# EAGLE design Bertha_v4_2 (EAGLE 7.5.0)
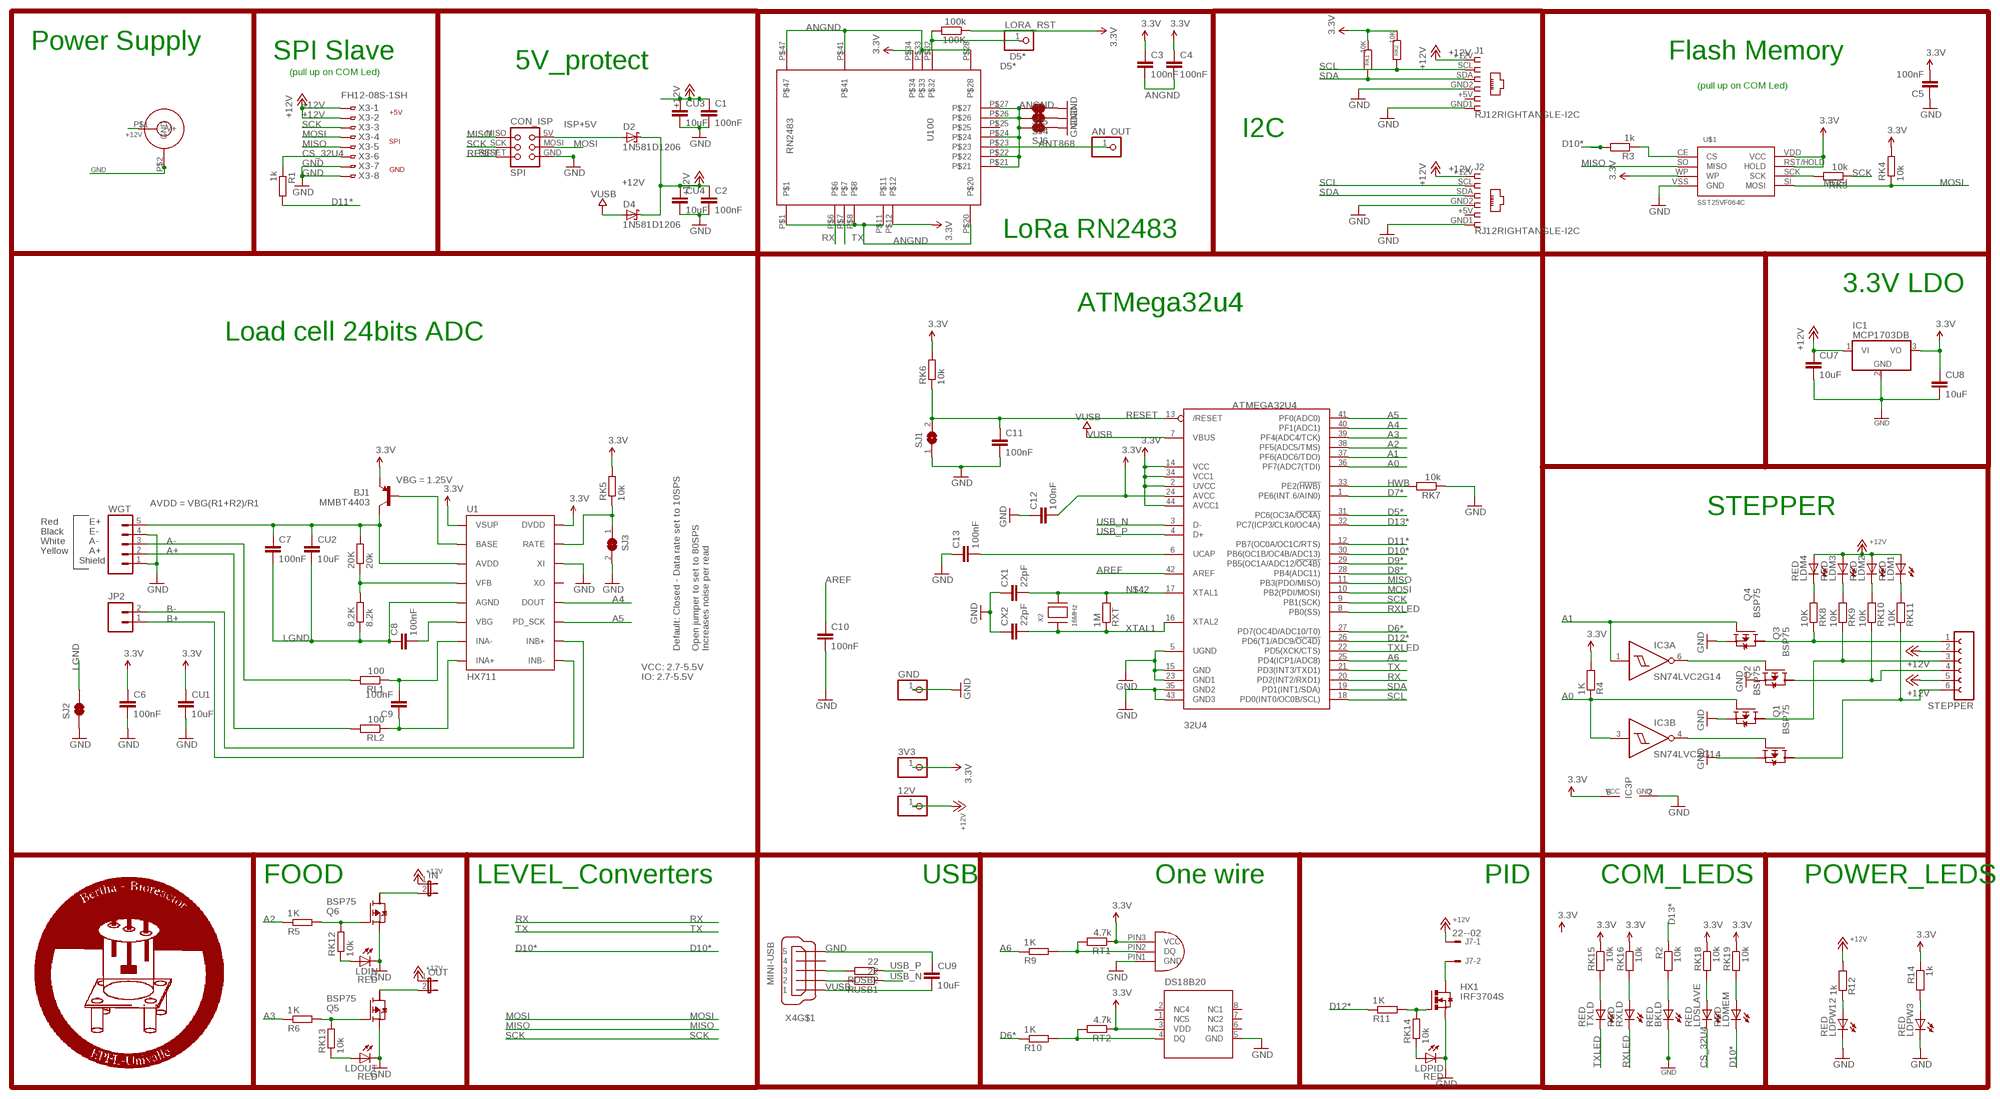
[diagram p0: schematic, sheet 1]

## Parts
3V3  PINHD-1X1  [1X01]
8.2K  8.2k  R-EU_M0805  [M0805]
12V  PINHD-1X1  [1X01]
20K  20k  R-EU_M0805  [M0805]
32U4  ATMEGA32U4  ATMEGA32U4-AU  [TQFP44]
100K  100k  R-EU_R0805  [R0805]
AN_OUT  PINHD-1X1  [1X01]
BJ1  MMBT4403  TRANSISTOR_PNPMMBT4403  [SOT23-3]
BKLD  RED  LEDCHIP-LED0805  [CHIP-LED0805]
C1  100nF  C-EUC1206  [C1206]
C2  100nF  C-EUC1206  [C1206]
C3  100nF  C-EUC1206  [C1206]
C4  100nF  C-EUC1206  [C1206]
C5  100nF  C-EUC1206  [C1206]
C6  100nF  C-EUC1206  [C1206]
C7  100nF  C-EUC1206  [C1206]
C8  100nF  C-EUC1206  [C1206]
C9  100nF  C-EUC1206  [C1206]
C10  100nF  C-EUC1206  [C1206]
C11  100nF  C-EUC1206  [C1206]
C12  100nF  C-EUC1206  [C1206]
C13  100nF  C-EUC1206  [C1206]
CON1  JACK_DC_BARREL  [DC_BARREL]
CON_ISP  SPI  TINYISPT  [TC2030-MCP-NL]
CU1  10uF  C-EUC1206  [C1206]
CU2  10uF  C-EUC1206  [C1206]
CU3  10uF  C-EUC1206  [C1206]
CU4  10uF  C-EUC1206  [C1206]
CU7  10uF  C-EUC1206  [C1206]
CU8  10uF  C-EUC1206  [C1206]
CU9  10uF  C-EUC1206  [C1206]
CX1  22pF  C-EUC1206  [C1206]
CX2  22pF  C-EUC1206  [C1206]
D2  1N581D1206  [LED-1206]
D4  1N581D1206  [LED-1206]
GND  PINHD-1X1  [1X01]
HX1  IRF3704S  [D2PACK]
IC1  MCP1703DB  [SOT223]
IC3  SN74LVC2G14  [SOT23-6]
IN  JP1E  [JP1]
J1  RJ12RIGHTANGLE-I2C  [RJ12-RIGHTANGLE-I2C]
J2  RJ12RIGHTANGLE-I2C  [RJ12-RIGHTANGLE-I2C]
J7  22--02  [2-PIN-5.08S]
JP2  M02PTH  [1X02]
LDIN  RED  LEDCHIP-LED0805  [CHIP-LED0805]
LDM1  RED  LEDCHIP-LED0805  [CHIP-LED0805]
LDM2  RED  LEDCHIP-LED0805  [CHIP-LED0805]
LDM3  RED  LEDCHIP-LED0805  [CHIP-LED0805]
LDM4  RED  LEDCHIP-LED0805  [CHIP-LED0805]
LDMEM  RED  LEDCHIP-LED0805  [CHIP-LED0805]
LDOUT  RED  LEDCHIP-LED0805  [CHIP-LED0805]
LDPID  RED  LEDCHIP-LED0805  [CHIP-LED0805]
LDPW3  RED  LEDCHIP-LED0805  [CHIP-LED0805]
LDPW12  RED  LEDCHIP-LED0805  [CHIP-LED0805]
LDSLAVE  RED  LEDCHIP-LED0805  [CHIP-LED0805]
LORA_RST  PINHD-1X1  [1X01]
OUT  JP1E  [JP1]
Q1  BSP75  BSP613P  [PG-SOT-223]
Q2  BSP75  BSP613P  [PG-SOT-223]
Q3  BSP75  BSP613P  [PG-SOT-223]
Q4  BSP75  BSP613P  [PG-SOT-223]
Q5  BSP75  BSP613P  [PG-SOT-223]
Q6  BSP75  BSP613P  [PG-SOT-223]
R1  1k  R-EU_R0805  [R0805]
R2  10k  R-EU_R0805  [R0805]
R3  1k  R-EU_R0805  [R0805]
R4  1K  R-EU_R0805  [R0805]
R5  1K  R-EU_R0805  [R0805]
R6  1K  R-EU_R0805  [R0805]
R9  1K  R-EU_R0805  [R0805]
R10  1K  R-EU_R0805  [R0805]
R11  1K  R-EU_R0805  [R0805]
R12  1k  R-EU_R0805  [R0805]
R14  1k  R-EU_R0805  [R0805]
RK1  10K  R-EU_M0805  [M0805]
RK2  10K  R-EU_M0805  [M0805]
RK3  10k  R-EU_R0805  [R0805]
RK4  10k  R-EU_R0805  [R0805]
RK5  10k  R-EU_M0805  [M0805]
RK6  10k  R-EU_M0805  [M0805]
RK7  10k  R-EU_M0805  [M0805]
RK8  10K  R-EU_R0805  [R0805]
RK9  10K  R-EU_R0805  [R0805]
RK10  10K  R-EU_R0805  [R0805]
RK11  10K  R-EU_R0805  [R0805]
RK12  10k  R-EU_R0805  [R0805]
RK13  10k  R-EU_R0805  [R0805]
RK14  10k  R-EU_R0805  [R0805]
RK15  10k  R-EU_R0805  [R0805]
RK16  10k  R-EU_R0805  [R0805]
RK18  10k  R-EU_R0805  [R0805]
RK19  10k  R-EU_R0805  [R0805]
RL1  100  R-EU_M0805  [M0805]
RL2  100  R-EU_M0805  [M0805]
RT1  4.7k  R-EU_R1206  [R1206]
RT2  4.7k  R-EU_R1206  [R1206]
RUSB1  22  R-EU_M1206  [M1206]
RUSB2  22  R-EU_M1206  [M1206]
RXLD  RED  LEDCHIP-LED0805  [CHIP-LED0805]
RXT  1M  R-EU_R0805  [R0805]
SJ1  SJ  [SJ]
SJ2  JUMPER-PAD-2-NC_BY_TRACE  [PAD-JUMPER-2-NC_BY_TRACE_YES_SILK]
SJ3  SJ  [SJ]
SJ4  JUMPER-PAD-2-NC_BY_TRACE  [PAD-JUMPER-2-NC_BY_TRACE_YES_SILK]
SJ5  JUMPER-PAD-2-NC_BY_TRACE  [PAD-JUMPER-2-NC_BY_TRACE_YES_SILK]
SJ6  JUMPER-PAD-2-NC_BY_TRACE  [PAD-JUMPER-2-NC_BY_TRACE_YES_SILK]
STEPPER  FE06-1  [FE06]
TXLD  RED  LEDCHIP-LED0805  [CHIP-LED0805]
U1  HX711  HX711HX711  [SO16]
U100  RN2483  [RN2483]
U$1  SST25VF064C  [SOIC_8-LEAD]
U$4  DS18B20  [SO8]
U$8  DS18B20_SMALLPADS  [SMALLPADS_X3]
WGT  M05PTH  [1X05]
X2  16MHz  XTALNX6035  [NX6035]
X3  FH12-08S-1SH  [FH12-08S-1SH]
X4  MINI-USB  MINI-USB-SCHIELD-32005-201  [32005-201]

## Nets
3.3V [power]: 3V3.1 32U4.2(UVCC) 32U4.14(VCC) 32U4.24(AVCC) 32U4.34(VCC1) 32U4.44(AVCC1) 100K.1 BJ1.2(E) C3.1 C4.1 C5.2 C6.1 C12.2 CU1.1 CU8.1 IC1.3(VO) IC3.5(P:VCC) R4.2 R14.1 RK1.1 RK2.1 RK4.2 RK5.2 RK6.2 RK15.1 RK16.1 RK18.1 RK19.1 RT1.1 RT2.1 U1.1(VSUP) U1.16(DVDD) U100.P$12 U100.P$34 U$1.RST/HOLD(HOLD) U$1.VDD(VCC) U$1.WP U$4.3(VDD) U$8.PIN3(VCC)
+12V [power]: 12V.1 C1.1 C2.1 CON1.P$1(V+) CU3.1 CU4.1 CU7.1 D2.C D4.C IC1.1(VI) IN.1 J1.+12V J2.+12V J7.1 LDM1.A LDM2.A LDM3.A LDM4.A OUT.1 R12.2 STEPPER.2 STEPPER.5 X3.1 X3.2
A0: 32U4.36(PF7(ADC7(TDI)) IC3.3(B:I) Q2.1(G) R4.1
A1: 32U4.37(PF6(ADC6/TDO)) IC3.1(A:I) Q4.1(G)
A2: 32U4.38(PF5(ADC5/TMS)) R5.1
A3: 32U4.39(PF4(ADC4/TCK)) R6.1
A4: 32U4.40(PF1(ADC1)) U1.12(DOUT)
A5: 32U4.41(PF0(ADC0)) U1.11(PD_SCK)
A6: 32U4.25(PD4(ICP1/ADC8)) R9.1
A+: RL2.2 WGT.2
A-: RL1.2 WGT.3
ANGND: C3.2 C4.2 SJ4.2 SJ5.2 SJ6.2 U100.P$1 U100.P$8 U100.P$11 U100.P$20 U100.P$21 U100.P$22 U100.P$24 U100.P$26 U100.P$27 U100.P$28 U100.P$33 U100.P$41 U100.P$47
ANT868: AN_OUT.1 U100.P$23
AREF: 32U4.42(AREF) C10.1
B+: JP2.1 U1.10(INB+)
B-: JP2.2 U1.9(INB-)
CN3: C8.2 U1.6(VBG)
CS_32U4: LDSLAVE.C R1.1 X3.6
D5*: 32U4.31(PC6(OC3A/!OC4A)) 100K.2 LORA_RST.1 U100.P$32
D6*: 32U4.27(PD7(OC4D/ADC10/T0)) R10.1
D7*: 32U4.1(PE6(INT.6/AIN0))
D8*: 32U4.28(PB4(ADC11))
D9*: 32U4.29(PB5(OC1A/ADC12/!OC4B))
D10*: 32U4.30(PB6(OC1B/OC4B/ADC13)) LDMEM.C R3.2
D11*: 32U4.12(PB7(OC0A/OC1C/RTS)) R1.2
D12*: 32U4.26(PD6(T1/ADC9/!OC4D)) R11.1
D13*: 32U4.32(PC7(ICP3/CLK0/OC4A)) R2.1
GND [power]: 32U4.5(UGND) 32U4.15(GND) 32U4.23(GND1) 32U4.35(GND2) 32U4.43(GND3) BKLD.C C1.2 C2.2 C5.1 C6.2 C10.2 C11.2 C12.1 C13.1 CON1.P$2(GND) CON_ISP.GND CU1.2 CU3.2 CU4.2 CU7.2 CU8.2 CU9.1 CX1.1 CX2.1 GND.1 HX1.3(S) IC1.2(GND) IC3.2(P:GND) J1.GND1 J1.GND2 J2.GND1 J2.GND2 LDIN.C LDOUT.C LDPID.C LDPW3.C LDPW12.C Q1.3(S) Q2.3(S) Q3.3(S) Q4.3(S) Q5.3(S) Q6.3(S) RK7.1 SJ1.1 SJ2.1 SJ3.2 SJ4.1 SJ5.1 SJ6.1 U1.14(XI) U$1.VSS(GND) U$4.5(GND) U$8.PIN1(GND) WGT.1 WGT.4 X3.7 X3.8 X4.5
HWB: 32U4.33(PE2(!HWB)) RK7.2
ISP+5V: CON_ISP.5V(VCC) D2.A
LGND: 8.2K.1 C7.2 C8.1 CU2.2 SJ2.2 U1.5(AGND)
MISO: 32U4.11(PB3(PDO/MISO)) CON_ISP.MISO U$1.SO(MISO) X3.5
MOSI: 32U4.10(PB2(PDI/MOSI)) CON_ISP.MOSI RK4.1 U$1.SI(MOSI) X3.4
N$1: 32U4.6(UCAP) C13.2
N$3: BKLD.A R2.2
N$5: 20K.2 BJ1.3(C) C7.1 CU2.1 U1.3(AVDD) WGT.5
N$6: HX1.1(G) R11.2 RK14.2
N$7: LDPW12.A R12.1
N$8: Q6.1(G) R5.2 RK12.2
N$9 [power]: R10.2 RT2.2 U$4.4(DQ)
N$10: R3.1 U$1.CE(CS)
N$11: Q5.1(G) R6.2 RK13.2
N$13: OUT.2 Q5.2(D)
N$14 [power]: Q4.2(D) RK8.1 STEPPER.1
N$15 [power]: Q2.2(D) RK9.1 STEPPER.3
N$16 [power]: Q3.2(D) RK10.1 STEPPER.4
N$17: IN.2 Q6.2(D)
N$18: RK15.2 TXLD.A
N$19 [power]: Q1.2(D) RK11.1 STEPPER.6
N$20: C9.2 RL1.1 U1.7(INA-)
N$21 [power]: R9.2 RT1.2 U$8.PIN2(DQ)
N$22: LDSLAVE.A RK18.2
N$23: RK3.2 U$1.SCK
N$24: RK16.2 RXLD.A
N$25: LDMEM.A RK19.2
N$26 [power]: LDPID.A RK14.1
N$27: LDIN.A RK12.1
N$28: LDOUT.A RK13.1
N$29: IC3.6(A:O) Q3.1(G)
N$30: IC3.4(B:O) Q1.1(G)
N$31: LDM4.C RK8.2
N$32: LDM3.C RK9.2
N$33: LDM2.C RK10.2
N$34: LDPW3.A R14.2
N$36: HX1.2(D) J7.2
N$37: LDM1.C RK11.2
N$38: BJ1.1(B) U1.2(BASE)
N$39: 8.2K.2 20K.1 U1.4(VFB)
N$41: RK5.1 SJ3.1 U1.15(RATE)
N$42: 32U4.17(XTAL1) CX1.2 RXT.2 X2.P$2
N$43: C9.1 RL2.1 U1.8(INA+)
RESET: 32U4.13(/RESET) C11.1 CON_ISP.RESET RK6.1 SJ1.2
RX: 32U4.20(PD2(INT2/RXD1)) U100.P$6
RXLED: 32U4.8(PB0(SS)) RXLD.C
SCK: 32U4.9(PB1(SCK)) CON_ISP.SCK RK3.1 X3.3
SCL: 32U4.18(PD0(INT0/OC0B/SCL)) J1.SCL J2.SCL RK2.2
SDA: 32U4.19(PD1(INT1/SDA)) J1.SDA J2.SDA RK1.2
TX: 32U4.21(PD3(INT3/TXD1)) U100.P$7
TXLED: 32U4.22(PD5(XCK/CTS)) TXLD.C
USB_N: 32U4.3(D-) RUSB1.1
USB_P: 32U4.4(D+) RUSB2.1
USBC_N: RUSB1.2 X4.2
USBC_P: RUSB2.2 X4.3
VUSB: 32U4.7(VBUS) CU9.2 D4.A X4.1
XTAL1: 32U4.16(XTAL2) CX2.2 RXT.1 X2.P$1
Unconnected: Q1.4(D) Q2.4(D) Q3.4(D) Q4.4(D) Q5.4(D) Q6.4(D) U1.13(XO) U100.P$25 U$4.1(NC5) U$4.2(NC4) U$4.6(NC3) U$4.7(NC2) U$4.8(NC1) X4.4 X4.M1(S:S1) X4.M2(S:S2) X4.M3(S:S3) X4.M4(S:S4)

## Notes on the sheet
- Power Supply
- SPI Slave | Flash Memory
- 5V_protect
- (pull up on COM Led)
- (pull up on COM Led)
- +5V
- I2C
- SPI
- GND
- LoRa RN2483
- 3.3V LDO
- ATMega32u4
- Load cell 24bits ADC
- VBG = 1.25V
- AVDD = VBG(R1+R2)/R1
- STEPPER
- Red | E+
- Black | E-
- White | A-
- Yellow | A+
- Shield
- Default: Closed - Data rate set to 10SPS
- Open jumper to set to 80SPS
  Increases noise per read
- VCC: 2.7-5.5V
- IO: 2.7-5.5V
- FOOD | LEVEL_Converters | USB | One wire | PID | COM_LEDS | POWER_LEDS

## Power pins joined to a net without a drawn wire
5: J1.+5V J2.+5V

## Library data of the parts
3V3 12V AN_OUT GND LORA_RST = Headerlibrary:PINHD-1X1: PIN HEADER
8.2K 20K R14 RK1 RK2 RK5-RK7 RL1 RL2 RT1 RT2 RUSB1 RUSB2 = resistor:R-EU_: RESISTOR, European symbol
32U4 = adafruit:ATMEGA32U4: http://www.ladyada.net/library/eagle
100K R1-R6 R9-R12 RK3 RK4 RK8-RK16 RK18 RK19 RXT = rcl:R-EU_: RESISTOR, European symbol
BJ1 = SparkFun-DiscreteSemi:TRANSISTOR_PNP: Generic PNP BJT Double check pinouts against datasheets- not all devices are the same! MMBT3906 - 40V 200mA SOT-23 (TRANS-08052) MMBT4403 - 40V 600mA SOT-23 (TRANS-09245); PROD_ID: TRANS-09245
BKLD LDIN LDM1-LDM4 LDMEM LDOUT LDPID LDPW3 LDPW12 LDSLAVE RXLD TXLD = adafruit:LED: LED OSRAM: - CHIPLED LG R971, LG N971, LY N971, LG Q971, LY Q971, LO R971, LY R971 LH N974, LH R974 LS Q976, LO Q976, LY Q976 LO Q996 - Hyper CHIPLED LW Q18S LB Q993, LB Q99A, LB R99A - SideLED LS A670, LO A670, LY A670, LG A670, LP A670 LB A673, LV A673, LT A673, LW A673 LH A674 LY A675 LS A676, LA A676, LO A676, LY A676, LW A676 LS A679, LY A679, LG A679 - Hyper Micro SIDELED® LS Y876, LA Y876, LO Y876, LY Y876 LT Y87S - SmartLED LW L88C, LW L88S LB L89C, LB L89S, LG L890 LS L89K, LO L89K, LY L89K LS L896, LA L896, LO L896, LY L896 - TOPLED LS T670, LO T670, LY T670, LG T670, LP T670 LSG T670, LSP T670, LSY T670, LOP T670, LYG T670 LG T671, LOG T671, LSG T671 LB T673, LV T673, LT T673, LW T673 LH T674 LS T676, LA T676, LO T676, LY T676, LB T676, LH T676, LSB T676, LW T676 LB T67C, LV T67C, LT T67C, LS T67K, LO T67K, LY T67K, LW E67C LS E67B, LA E67B, LO E67B, LY E67B, LB E67C, LV E67C, LT E67C LW T67C LS T679, LY T679, LG T679 LS T770, LO T770, LY T770, LG T770, LP T770 LB T773, LV T773, LT T773, LW T773 LH T774 LS E675, LA E675, LY E675, LS T675 LS T776, LA T776, LO T776, LY T776, LB T776 LHGB T686 LT T68C, LB T68C - Hyper Mini TOPLED® LB M676 - Mini TOPLED Santana® LG M470 LS M47K, LO M47K, LY M47K Source: http://www.osram.convergy.de/
C1-C13 CU1-CU4 CU7-CU9 CX1 CX2 = rcl:C-EU: CAPACITOR, European symbol
CON1 = lpatiny:JACK_DC_BARREL
CON_ISP = lpatiny:TINYISP: CONNECTOR
D2 D4 = lpatiny:1N581*: 1.0A SCHOTTKY BARRIER RECTIFIER Source: http://www.diodes.com/datasheets/ds23001.pdf
HX1 = transistor-power:IRF3704: SMPS MOSFET HEXFET® Power MOSFET Source: http://www.irf.com/product-info/datasheets/data/irf3704.pdf
IC1 = linear:MCP1703: 250 mA, 16V, Low Quiescent Current LDO Regulator Source: http://ww1.microchip.com/downloads/en/DeviceDoc/22049b.pdf
IC3 = lpatiny:SN74LVC2G14: Dual schmitt trigger INVERTER
IN OUT = jumper:JP1E: JUMPER
J1 J2 = lpatiny:RJ12: CORCOM Modular RJ Jacks No Shield Source: www.tycoelectronics.com .. ENG_DS_1654001_1099_RJ_L_0507.pdf
J7 = lpatiny:22-?-02: CONNECTOR wire to board 2.54 mm (.1 inch) pitch header
JP2 = SparkFun-Connectors:M02: Standard 2-pin 0.1" header. Use with - straight break away headers ( PRT-00116) - right angle break away headers (PRT-00553) - swiss pins (PRT-00743) - machine pins (PRT-00117) - female headers (PRT-00115) Molex polarized connector foot print use with: PRT-08233 with associated crimp pins and housings. 2.54_SCREWTERM for use with PRT-10571. 3.5mm Screw Terminal footprints for PRT-08084 5mm Screw Terminal footprints for use with PRT-08432
Q1-Q6 = infineon:BSP613P: SIPMOS (R) Small-Signal-Transistor P-Channel (2 Drain) Source: http://www.infineon.com/dgdl/BSP613P_Rev2.4.pdf; OC_FARNELL: unknown; OC_NEWARK: unknown
SJ1 SJ3 = jumper:SJ: SMD solder JUMPER
SJ2 SJ4-SJ6 = SparkFun-Passives:JUMPER-PAD-2-NC_BY_TRACE
STEPPER = con-lsta:FE06-1: FEMALE HEADER; OC_FARNELL: unknown; OC_NEWARK: unknown
U1 = Testing:HX711; PROD_ID: IC-12445
U100 = Octanis1:RN2483: Microchip Low-Power Long Range LoRaTM Technology Transceiver Module
U$1 = BertaLib:SST25VF064C
U$4 = lpatiny:DS18B20
U$8 = lpatiny:DS18B20_SMALLPADS
WGT = SparkFun-Connectors:M05: Header 5 Standard 5-pin 0.1" header. Use with straight break away headers (SKU : PRT-00116), right angle break away headers (PRT-00553), swiss pins (PRT-00743), machine pins (PRT-00117), and female headers (PRT-00115). Molex polarized connector foot print use with SKU : PRT-08230 with associated crimp pins and housings.
X2 = lpatiny:XTAL: Low cost SMT crystals, no capacitors included http://www.ladyada.net/library/eagle
X3 = con-hirose:FH12-08S-1S: 1mm Pitch Connectors For FPC/FFC Source: Data sheet <http://www.hirose.co.jp/cataloge_hp/e58605370.pdf>; OC_FARNELL: unknown; OC_NEWARK: unknown
X4 = con-cypressindustries:MINI-USB-SCHIELD-: MINI USB-B Conector Source: www.cypressindustries.com; OC_FARNELL: unknown; OC_NEWARK: unknown

## Net classes
0 default: width 0.203 mm
1 power: width 0.203 mm, drill 0.305 mm, clearance 0.152 mm
2 VIN: width 0.457 mm
3 fine: width 0.254 mm
4 aref: width 0.356 mm

## Board
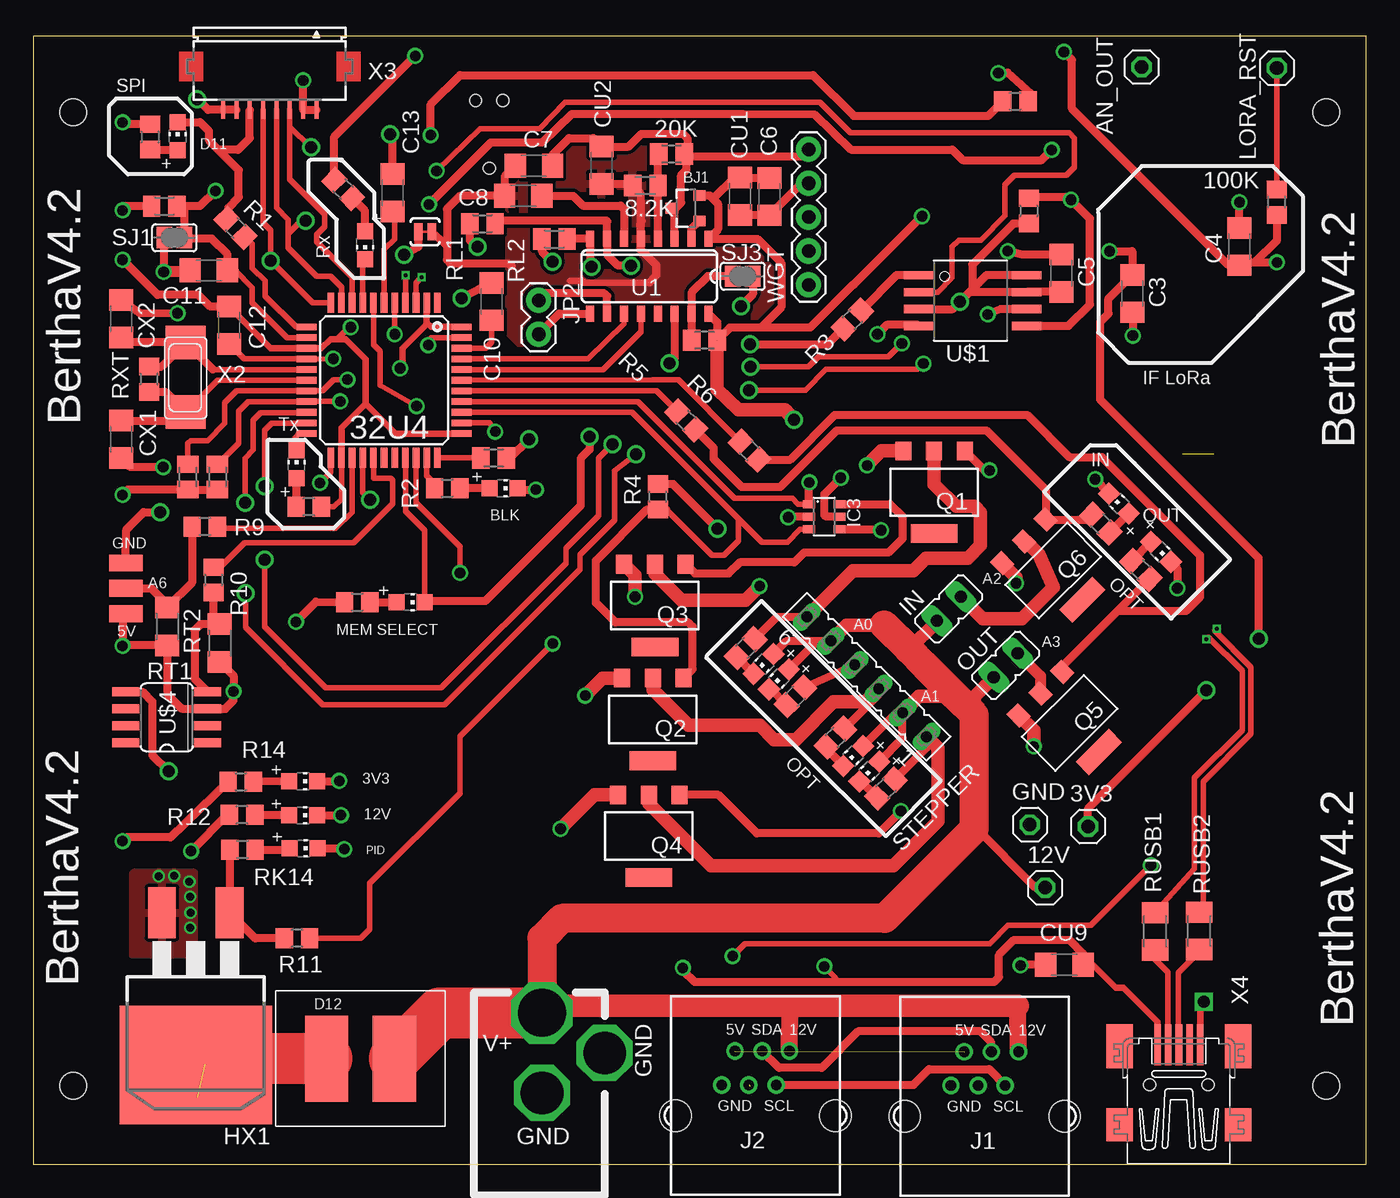
[diagram p1: board, top side]
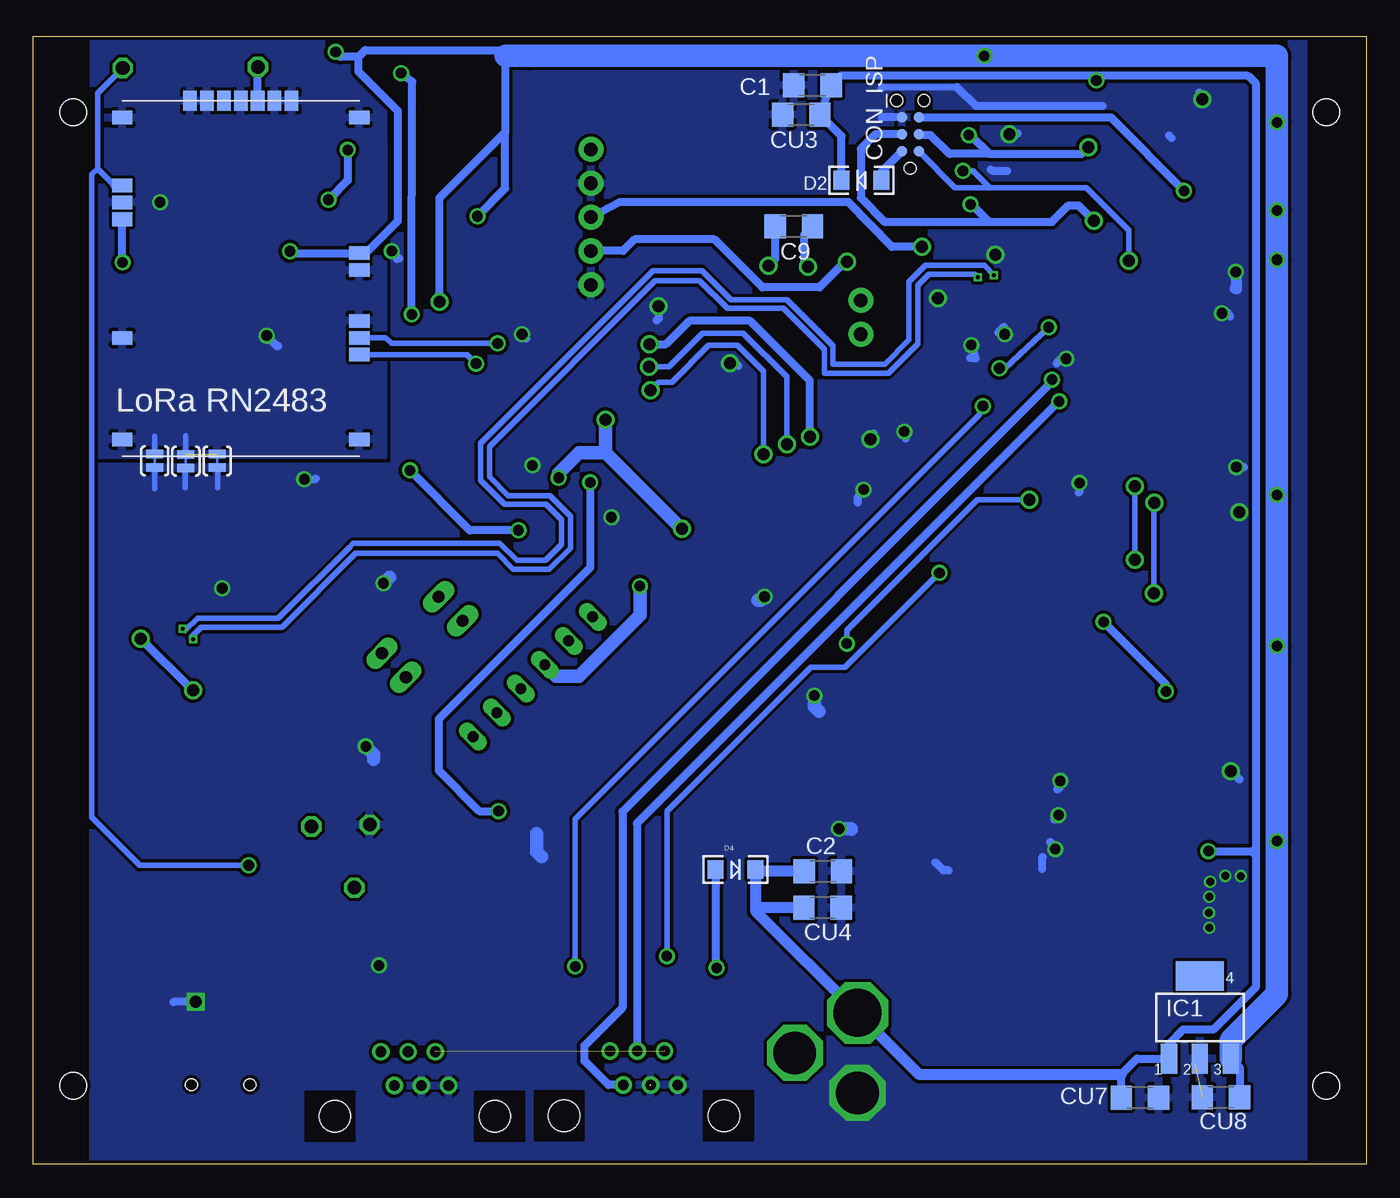
[diagram p2: board, bottom side, seen from below]

Size 100 x 84.6 mm. Coordinates in mm from the lower left corner, seen from the top.
Outline: 0,0 100,0 100,84.6 0,84.6 0,0
Copper layers (1*2*15*16): Top 0.035mm / dielectric 0.2mm / layer 2 0.0175mm / dielectric 1.1mm / layer 15 0.0175mm / dielectric 0.2mm / Bottom 0.035mm
Design rules "SeeedStudio_DRU_no_angle_20130527": minimum track width 6mil, minimum drill 12mil, track to track 6mil, track to pad 6mil, pad to pad 6mil, via to via 6mil, smd to smd 0mil, copper to edge 10mil, drill to drill 10mil, minimum pad ring 6mil, minimum via ring 6mil, stop-mask expansion 2mil, vias tented up to drill 25mil, thermal gap 10mil
Holes 2 mm at 3,78.9 97,78.9 3,5.9 97,5.9
vRestrict: area 13.7,78 to 21.9,81.8

### Footprints (pad centres in the part's own frame; a part is rotated, then mirrored left to right if it is on the bottom)
1X01 = drill 1.016 octagon: 1 0,0
M0805 = smd 1.3 x 1.6: 1 -0.95,0; 2 0.95,0
TQFP44 = smd 1.5 x 0.5: 1 -5.8,4; 2 -5.8,3.2; 3 -5.8,2.4; 4 -5.8,1.6; 5 -5.8,0.8; 6 -5.8,0; 7 -5.8,-0.8; 8 -5.8,-1.6; 9 -5.8,-2.4; 10 -5.8,-3.2; 11 -5.8,-4; 23 5.8,-4; 24 5.8,-3.2; 25 5.8,-2.4; 26 5.8,-1.6; 27 5.8,-0.8; 28 5.8,0; 29 5.8,0.8; 30 5.8,1.6; 31 5.8,2.4; 32 5.8,3.2; 33 5.8,4 | smd 0.5 x 1.5: 12 -4,-5.8; 13 -3.2,-5.8; 14 -2.4,-5.8; 15 -1.6,-5.8; 16 -0.8,-5.8; 17 0,-5.8; 18 0.8,-5.8; 19 1.6,-5.8; 20 2.4,-5.8; 21 3.2,-5.8; 22 4,-5.8; 34 4,5.8; 35 3.2,5.8; 36 2.4,5.8; 37 1.6,5.8; 38 0.8,5.8; 39 0,5.8; 40 -0.8,5.8; 41 -1.6,5.8; 42 -2.4,5.8; 43 -3.2,5.8; 44 -4,5.8
R0805 = smd 1.3 x 1.5: 1 -0.95,0; 2 0.95,0
SOT23-3 = smd 0.8 x 0.9: 1 -0.95,-1; 2 0.95,-1; 3 0,1.1
CHIP-LED0805 = smd 1.2 x 1.2: A 0,-1.05; C 0,1.05
C1206 = smd 1.6 x 1.8: 1 -1.4,0; 2 1.4,0
DC_BARREL = drill 3.6 pad 4.5 octagon: P$1 0,13.7 | drill 3.2 pad 4.064 octagon: P$2 0,7.7; P$3 4.7,10.7
TC2030-MCP-NL = smd 0.787 x 0.787: 5V 1.27,0.635; GND 3.81,0.635; MISO 1.27,-0.635; MOSI 2.54,0.635; RESET 3.81,-0.635; SCK 2.54,-0.635 | hole 0.889: 0,0; 5.08,-1.016; 5.08,1.016
LED-1206 = smd 1.2 x 1.4: A -1.5,0; C 1.5,0
D2PACK = smd 2.083 x 3.81: 1 -2.54,-8.89; 3 2.54,-8.89 | smd 11.43 x 8.89: 2 0,2.54
SOT223 = smd 1.219 x 2.235: 1 -2.311,-3.099; 2 0,-3.099; 3 2.311,-3.099 | smd 3.6 x 2.2: 4 0,3.099
SOT23-6 = smd 0.6 x 0.9: 1 -0.95,-1.15; 2 0,-1.15; 3 0.95,-1.15; 4 0.95,1.15; 5 0,1.15; 6 -0.95,1.15
JP1 = drill 0.914 long: 1 0,-1.27; 2 0,1.27
RJ12-RIGHTANGLE-I2C = drill 0.8 pad 1.3: +5V -1.54,4.84; +12V 2.54,4.84; GND1 -2.54,2.3; GND2 -0.5,2.3; SCL 1.54,2.3; SDA 0.5,4.84 | hole 2.36: -6,0; 6,0
2-PIN-5.08S = smd 3.251 x 6.452: 1 -2.54,0; 2 2.54,0
1X02 = drill 1.016 pad 1.88: 1 0,0; 2 2.54,0
PG-SOT-223 = smd 1.2 x 1.4: 1 -2.311,-3.099; 2 0,-3.099; 3 2.311,-3.099 | smd 3.5 x 1.4: 4 0,3.099
R1206 = smd 1.6 x 1.803: 1 -1.422,0; 2 1.422,0
M1206 = smd 1.6 x 2: 1 -1.4,0; 2 1.4,0
SJ = smd 1.168 x 1.6: 1 -0.762,0; 2 0.762,0
PAD-JUMPER-2-NC_BY_TRACE_YES_SILK = smd 0.635 x 1.27: 1 -0.508,0; 2 0.508,0
FE06 = drill 0.813 long: 1 -6.35,0; 2 -3.81,0; 3 -1.27,0; 4 1.27,0; 5 3.81,0; 6 6.35,0
SO16 = smd 0.6 x 1.2: 1 -4.445,-2.8; 2 -3.175,-2.8; 3 -1.905,-2.8; 4 -0.635,-2.8; 5 0.635,-2.8; 6 1.905,-2.8; 7 3.175,-2.8; 8 4.445,-2.8; 9 4.445,2.8; 10 3.175,2.8; 11 1.905,2.8; 12 0.635,2.8; 13 -0.635,2.8; 14 -1.905,2.8; 15 -3.175,2.8; 16 -4.445,2.8
RN2483 = smd 1.524 x 1.016: P$1 17.78,1.27; P$6 17.78,7.62; P$7 17.78,8.89; P$8 17.78,10.16; P$11 17.78,13.97; P$12 17.78,15.24; P$20 17.78,25.4; P$28 0,25.4; P$32 0,20.32; P$33 0,19.05; P$34 0,17.78; P$41 0,8.89; P$47 0,1.27 | smd 1.016 x 1.524: P$21 12.7,26.67; P$22 11.43,26.67; P$23 10.16,26.67; P$24 8.89,26.67; P$25 7.62,26.67; P$26 6.35,26.67; P$27 5.08,26.67
SOIC_8-LEAD = smd 0.61 x 2.21: CE -1.905,-2.934; RST/HOLD -0.635,5.156; SCK 0.635,5.156; SI 1.905,5.156; SO -0.635,-2.934; VDD -1.905,5.156; VSS 1.905,-2.934; WP 0.635,-2.934
SO8 = smd 0.66 x 2.032: 1 -3.81,-3.073; 2 -2.54,-3.073; 3 -1.27,-3.073; 4 0,-3.073; 5 0,3.073; 6 -1.27,3.073; 7 -2.54,3.073; 8 -3.81,3.073
SMALLPADS_X3 = smd 1.27 x 2.54: PIN1 -1.905,0; PIN2 0,0; PIN3 1.905,0
1X05 = drill 1.016 pad 1.88: 1 0,0; 2 2.54,0; 3 5.08,0; 4 7.62,0; 5 10.16,0
NX6035 = smd 2.5 x 3: P$1 2.665,0; P$2 -2.565,0
FH12-08S-1SH = smd 0.3 x 1.3: 1 -3.5,3.25; 2 -2.5,3.25; 3 -1.5,3.25; 4 -0.5,3.25; 5 0.5,3.25; 6 1.5,3.25; 7 2.5,3.25; 8 3.5,3.25
32005-201 = smd 3.1 x 0.5: 1 3,1.6; 2 3,0.8; 3 3,0; 4 3,-0.8; 5 3,-1.6 | smd 2.5 x 2: M1 -3,-4.45; M2 -3,4.45 | smd 3.3 x 2: M3 2.9,4.45; M4 2.9,-4.45 | hole 0.9: 0,2.2; 0,-2.2

### Placement (x,y rotation side)
3V3  79.13,25.34 0 top
8.2K  45.92,73.41 0 top
12V  75.9,20.75 0 top
20K  47.88,75.77 0 top
32U4  26.31,58.81 270 top
100K  93.29,72.16 90 top
AN_OUT  83.14,82.3 0 top
BJ1  48.97,71.71 90 top
BKLD  35.29,50.7 270 top
C1  41.55,80.92 180 bottom
C2  40.77,21.97 0 bottom
C3  82.44,65.31 270 top
C4  90.48,68.84 90 top
C5  77.11,66.84 270 top
C6  55.23,72.58 270 top
C7  37.55,74.88 180 top
C8  36.76,72.63 0 top
C9  42.94,70.36 180 bottom
C10  34.4,64.71 90 top
C11  13.17,67.04 180 top
C12  14.68,62.93 90 top
C13  26.94,72.87 270 top
CON1  38.16,-2.34 0 top
CON_ISP  34.21,74.71 90 bottom
CU1  53.03,72.61 270 top
CU2  42.62,74.94 270 top
CU3  42.39,78.74 180 bottom
CU4  40.78,19.25 0 bottom
CU7  16.97,4.98 0 bottom
CU8  10.89,5.02 180 bottom
CU9  77.35,14.95 0 top
CX1  6.6,54.38 90 top
CX2  6.6,63.42 270 top
D2  37.87,73.81 180 bottom
D4  47.3,22.11 0 bottom
GND  74.76,25.48 0 top
HX1  12.19,9.98 180 top
IC1  12.47,11.02 0 bottom
IC3  59.34,48.57 270 top
IN  68.69,41.67 315 top
J1  71.38,3.61 0 top
J2  54.19,3.66 0 top
J7  24.55,7.93 180 top
JP2  37.91,64.8 270 top
LDIN  81.44,49.57 45 top
LDM1  54.79,37.53 135 top
LDM2  55.93,36.38 135 top
LDM3  61.52,30.63 135 top
LDM4  62.72,29.46 135 top
LDMEM  28.29,42.18 270 top
LDOUT  84.6,45.94 225 top
LDPID  20.3,23.7 270 top
LDPW3  20.23,28.73 270 top
LDPW12  20.23,26.18 270 top
LDSLAVE  10.83,77.12 0 top
LORA_RST  93.29,82.22 0 top
OUT  72.95,37.43 315 top
Q1  67.58,50.41 180 top
Q2  46.48,33.37 180 top
Q3  46.64,41.91 180 top
Q4  46.19,24.62 180 top
Q5  77.75,33.11 225 top
Q6  76.51,44.53 225 top
R1  15.17,70.23 315 top
R2  31.05,50.72 0 top
R3  61.45,63.37 225 top
R4  46.86,50.07 90 top
R5  48.98,55.8 315 top
R6  53.73,53.53 315 top
R9  12.86,47.83 180 top
R10  13.52,43.83 270 top
R11  19.78,16.95 180 top
R12  15.66,26.21 180 top
R14  15.57,28.7 0 top
RK1  13.82,51.55 90 top
RK2  11.6,51.56 90 top
RK3  73.68,79.73 0 top
RK4  74.69,71.5 270 top
RK5  50.36,61.81 0 top
RK6  9.84,71.86 180 top
RK7  34.54,52.98 180 top
RK8  63.97,28.19 225 top
RK9  60.18,32.01 225 top
RK10  57.18,35.11 225 top
RK11  53.45,38.73 225 top
RK12  80.09,48.05 135 top
RK13  83.09,44.59 315 top
RK14  15.69,23.6 180 top
RK15  20.67,49.32 180 top
RK16  23.25,73.15 315 top
RK18  8.76,77.06 270 top
RK19  24.3,42.17 0 top
RL1  33.7,70.55 180 top
RL2  39.09,69.39 180 top
RT1  10.05,40.34 90 top
RT2  13.99,39.09 90 top
RUSB1  84.16,17.47 270 top
RUSB2  87.47,17.5 270 top
RXLD  24.88,68.93 180 top
RXT  8.68,58.89 270 top
SJ1  10.59,69.5 0 top
SJ2  29.39,69.93 0 top
SJ3  53.22,66.61 0 top
SJ4  88.55,52.74 90 bottom
SJ5  86.21,52.76 90 bottom
SJ6  90.88,52.76 90 bottom
STEPPER  62.53,36.57 135 top
TXLD  19.75,52.51 0 top
U1  46.22,66.61 180 top
U100  93.33,53.1 0 bottom
U$1  69.37,64.79 270 top
U$4  10.02,35.43 90 top
U$8  6.95,43.2 270 top
WGT  58.17,65.96 90 top
X2  8MHz  [NX6035]  11.43,58.99 90 top
X3  17.75,82.33 180 top
X4  85.94,5.98 90 top

### Tracks (layer width: path | path; a pad name or v marks a point on that pad's centre or on a via)
3.3V  (via drill 0.8, 0.8 pad 0.81, 0.9, 0.9 pad 0.61)  (1 unrouted)
  Top 0.406: 20.53,61.21 32U4.14 | RK15.1 22.54,49.32 23.11,49.89 32U4.24
  Top 0.5: 32U4.14 17.8,61.21 C12.2 | 24.93,57.06 23.11,55.24 32U4.24 | 24.93,57.06 24.93,60.39 23.44,61.88 22.81,61.88 | 22.81,61.88 22.3,61.88 21.58,61.21 20.53,61.21 | 32U4.34 27.18,54.81 24.93,57.06 | 32U4.44 29.83,62.81 29.52,63.12 | 32U4.2 29.52,63.12 | 29.52,63.12 29.52,63.02 27.7,61.2 27.7,59.89 v27.52,59.71 | 23.81,62.88 22.81,61.88
  Top 0.61: R14.1 10.29,24.52 6.97,24.52 v6.7,24.24 | U$1.WP 68.97,64.15 v69.52,64.7 | U$1.VDD 71.51,66.69 70.46,65.64 | v69.52,64.7 70.45,65.64 70.46,65.64 | v69.52,64.7 70.24,65.42 U$1.RST/HOLD 74.54,65.44 C5.2 | RK4.2 73.53,70.55 70.46,67.48 70.46,65.64 | 91.65,67.65 90.69,67.65 arc90 C4.1 89.66,67.44 77.92,79.18 77.92,82.83 v77.32,83.43 | 91.65,67.65 v93.3,67.65 | 93.32,69.32 93.29,69.29 | 93.29,69.29 91.65,67.65 | 100K.1 93.29,69.29 | 3V3.1 79.13,26.65 v88.02,35.55 | v23.81,62.78 23.81,62.88 | 54.59,62.76 58.28,62.76 61.52,66 61.58,66 v66.68,71.11 | 54.59,62.76 52.26,62.76 RK5.2 51.31,63.16 U1.16 | 54.59,62.76 56.11,64.29 56.11,67.62 54.32,69.41 U1.1 51.36,70.1 51.36,72.05 51,72.42 | 51,72.42 50.75,72.66 BJ1.2 | 51,72.42 52.59,74.01 CU1.1 53.06,73.98 C6.1 | RT2.1 15.01,36.65 v15.01,35.48 v15.01,35.47 15.01,34.77 14.4,34.16 U$4.3 13.07,34.18 11.12,34.18 10.05,35.24 RT1.1 6.7,38.92 v6.7,38.89 6.7,41.15 6.81,41.15 U$8.PIN3 | IC3.5 59.48,48.57 59.35,48.7 59.35,50.27 v60.58,51.5 | RK6.2 6.7,71.86 v6.7,71.55 | C12.2 13.27,64.33 12.38,65.22 9.32,65.22 v6.7,67.84 | RK18.1 6.7,78.01 v6.7,78.15 | v6.7,50.21 7.11,50.61 RK2.1 13.81,50.61 RK1.1 | v51.34,47.69 48,51.02 R4.2 | RK16.1 22.58,77.06 v28.66,83.14 | v19.71,40.69 21.21,42.2 RK19.1 | v91.93,39.44 91.93,45.48 80.04,57.36 80.04,63.18 80.67,63.8 80.67,64.93 C3.1 82.44,68.48 v80.74,68.48
  Top 1.016: v57.07,55.86 56.41,56.61 52.92,56.61 51.31,58.14 RK5.2
  Bottom 0.5: v27.52,59.71 27.11,59.71 v23.81,62.78
  Bottom 0.61: v69.52,64.7 69.52,72.48 64.59,77.41 | 75.61,83.06 75.61,81.95 72.65,78.99 72.65,70.76 75.06,68.34 U100.P$12 80.86,68.34 v80.74,68.48 | 75.61,83.06 75.1,83.57 63.2,83.57 62.77,83.14 | 64.59,77.41 64.59,82.9 64.36,83.14 | v93.3,67.65 arc90 93.33,67.67 U100.P$34 | 75.61,83.06 76.95,83.06 v77.32,83.43 | v88.02,35.55 88.04,35.55 v91.93,39.44 | v60.58,51.5 60.58,51.85 | 57.08,53.38 57.07,53.38 | 6.7,37.81 6.7,37.84 | v19.71,40.69 15.01,36 v15.01,35.48 | v66.68,71.11 64.59,73.19 64.59,77.41 | IC1.3 9.49,7.25 CU8.1
  Bottom 1.016: 60.58,51.85 59.05,53.38 57.08,53.38 | v57.07,55.86 57.07,53.38 51.38,47.69 v51.34,47.69
  Bottom 1.676: IC1.3 10.16,9.31 6.7,12.78 v6.7,24.24 6.7,37.81 | 6.7,37.84 v6.7,38.89 v6.7,50.21 v6.7,67.84 v6.7,71.55 v6.7,78.15 6.7,83.14 v28.66,83.14 62.77,83.14 64.36,83.14 64.55,83.14 64.55,83.15
5  (1 unrouted)
+12V  (via drill 0.8)
  Top 0.61: LDM1.A 56.52,39.27 STEPPER.5 | 59.69,39.27 STEPPER.5 | LDM4.A 65.22,31.96 STEPPER.2 64.77,33.88 LDM3.A | LDM2.A 58.82,39.27 STEPPER.5 | 12V.1 75.19,20.75 70.59,25.35 | X3.1 X3.2 20.25,79.84 v20.24,81.29 | R12.2 14.55,26.21 v11.83,23.49
  Top 1.016: STEPPER.2 66.45,35.11 69.2,35.11 | STEPPER.5 61.02,40.45 63.85,40.45 | 70.59,30.43 70.59,29.5 | OUT.1 70.59,35.07 70.59,33.01 | IN.1 67.79,40.71 65.69,38.62
  Top 1.27: J2.+12V 56.78,11.89 | J1.+12V 73.88,11.89
  Top 1.676: 73.88,11.89 56.78,11.89 38.8,11.89 38.8,11.64 38.69,11.64 38.16,11.64 CON1.P$1
  Top 2.184: 38.69,11.64 38.16,12.17 38.16,16.97 39.64,18.45 63.88,18.45 70.59,25.16 70.59,25.35 70.59,29.5 70.59,33.01 70.59,33.72 69.2,35.11 66.9,37.4 65.69,38.62 63.85,40.45
  Top 3.81: J7.1 30.51,11.36 CON1.P$1
  Bottom 0.61: CU7.1 18.39,5 18.39,6.73 17.2,7.93 IC1.1 14.79,9.06 13.74,10.11 11.47,10.11 8.25,13.33 8.25,23.16 | D2.C 39.37,77.12 CU3.1 C1.1 39.43,81.65 20.17,81.65 | 8.25,23.16 8.25,81.04 8.86,81.64 20.17,81.65 | v11.83,23.49 8.58,23.49 8.25,23.16 | 20.17,81.65 20.17,81.37 v20.24,81.29
  Bottom 0.813: 45.8,19.58 D4.C 45.66,21.97 C2.1 | 45.8,19.58 45.8,19 CON1.P$1 33.53,6.73 18.39,6.73 | CU4.1 45.47,19.25 45.8,19.58
A0
  Top 0.406: IC3.3 57.52,47.62 56.56,46.67 54.67,46.67 52.9,48.43 | 52.9,48.43 44.93,56.41 32U4.36 | 52.9,48.43 52.9,46.76 51.83,45.69 50.91,45.69 47.48,49.12
  Top 0.61: 47.48,49.12 R4.1 46.05,49.12 42.2,45.28 42.2,42.11 43.67,40.64 49.16,40.64 49.47,40.33 49.47,37.14 Q2.1
A1  (via drill 0.8, 0.8 pad 0.81)
  Top 0.406: IC3.1 57.38,49.52 56.94,49.96 52.62,49.96 45.38,57.21 32U4.37
  Top 0.61: IC3.1 58.19,51.12 v58.22,51.15 | v65.1,26.5 63.43,24.83 54.28,24.83 51.39,27.71 Q4.1
  Bottom 0.61: v58.22,51.15 58.22,44.76 69.59,33.39 69.59,29.55 66.54,26.5 v65.1,26.5
A2
  Top 0.406: R5.1 46.77,58.01 32U4.38
A3
  Top 0.406: 32U4.39 32.19,58.81 46.44,58.83 48.4,58.83 53.03,54.2
  Top 0.61: R6.1 53.03,54.2
A4
  Top 0.406: 32U4.40 42.76,59.61 45.58,62.43 U1.12
A5
  Top 0.406: U1.11 44.31,63.06 41.62,60.42 41.61,60.41 32U4.41
A6
  Top 0.406: 32U4.25 23.91,48.91 22.7,47.7 13.95,47.7
  Top 0.61: 13.95,47.7 R9.1
A+  (via drill 0.9 pad 0.81)
  Top 0.61: RL2.2 38.14,68.5 v38.95,67.69
  Bottom 0.61: v38.95,67.69 39.09,67.69 41.01,65.78 45.31,65.78 46.83,67.3 | 46.83,67.3 | 46.83,67.3 48.9,69.37 54.88,69.37 55.74,68.5 WGT.2
A-  (via drill 0.9 pad 0.81)
  Top 0.61: RL1.2 32.75,69.3 v33.32,68.81
  Bottom 0.61: v33.32,68.81 35.6,68.82 38.83,72.18 56.02,72.18 WGT.3
ANGND  (via drill 0.8)  (1 unrouted)
  Top 0.61: C3.2 82.5,63.85 v82.5,62.15 | C4.2 arc90 C4.2 v90.49,72.16
  Bottom 0.406: SJ6.2 90.9,53.27 90.9,54.6 | SJ4.2 88.59,53.25 88.59,54.65
  Bottom 0.61: v82.5,62.15 81.71,61.37 81.62,61.37 | v90.49,72.16 arc-90 90.41,72.23 | 90.41,72.23
  pour Bottom (rank 2): 73.82,85.13 95.5,85.13 95.44,53.22 73.64,53.22 73.73,84.51
ANT868
  Bottom 0.61: U100.P$23 83.17,82.27 AN_OUT.1
AREF
  Top 0.406: 32U4.42 33.93,61.21 33.94,61.2 34.4,61.65 C10.1
B+
  Top 0.61: U1.10 43.04,65.13 42.86,65.31 38.4,65.31 JP2.1
B-
  Top 0.61: JP2.2 39.46,63.81 U1.9
CN3
  Top 0.61: 44.35,69.44 U1.6 44.33,69.43 44.33,71.63 44.06,71.91 41.23,71.91 40.5,72.63 C8.2
CS_32U4
  Top 0.61: 13.87,76.11 15.37,76.09 16.25,76.97 X3.6 | LDSLAVE.C 12.5,78.17 13.16,77.51 13.16,76.83 13.87,76.11 | R1.1 14.64,71.76 15.41,72.53 15.41,74.58 13.87,76.11
D5*  (via drill 0.8)
  Top 0.406: 100K.2 LORA_RST.1 | 32U4.31 28.71,49.61 32.02,46.31 v32.02,44.36 | v52.47,15.62 53.41,16.55 71.75,16.55 73.12,17.92 79.34,17.92 v83.85,22.43
  Top 0.61: LORA_RST.1
  Bottom 0.406: 93.93,73.42 95.19,74.68 | v32.02,44.36 39.11,37.27 41.67,37.27 52.47,26.46 v52.47,15.62 | v83.85,22.43 92.02,22.43 95.62,26.02 95.62,74.25 95.19,74.68 | LORA_RST.1 95.19,80.33 95.19,74.68
  Bottom 0.61: U100.P$32 93.93,73.42
D6*
  Top 0.406: 32U4.27 25.52,51.5 25.54,51.47 26.8,51.47 26.95,51.31 26.95,49.55 24.02,46.62 15.84,46.62 14,44.78
  Top 0.61: R10.1 14,44.78
D10*  (via drill 0.9 pad 0.61)
  Top 0.406: 32U4.30 27.91,48.97 29.34,47.55 LDMEM.C
  Top 0.61: v53.78,61.51 59.6,61.51 R3.2 | v41.73,54.57 41.73,53.62 41.07,52.96 41.07,49.4 33.91,42.23 29.4,42.23 LDMEM.C
  Bottom 0.61: v41.73,54.57 41.73,58.78 46.22,63.27 50.78,63.27 52.53,61.51 v53.78,61.51
D11*
  Top 0.406: 32U4.12 19.71,62.81 17.4,65.12 17.4,66.25 16.43,67.22 16.43,69.06 R1.2
D12*  (via drill 0.8, 0.9 pad 0.61)
  Top 0.406: v25.26,49.84 24.7,50.39 32U4.26 | R11.1 24.55,16.95 25.24,17.64 25.24,21.07 32.01,27.84 32.01,32.1 v38.96,39.06
  Bottom 0.406: v25.26,49.84 29.17,49.84 38.96,40.05 v38.96,39.06
D13*
  Top 0.406: 32U4.32 29.5,53 29.5,51.64 30.1,51.05
  Top 0.61: 30.1,51.05 R2.1
GND  (via drill 0.6, 0.8, 0.8 pad 0.41, 0.8 pad 0.81, 0.9, 0.9 pad 0.61, 0.9 pad 0.81)  (2 unrouted)
  Top 0.406: 22.43,60.39 32U4.15 15.8,60.41 C12.1 | 32U4.5 27.11,62.88 v27.12,62.26 | 32U4.23 22.32,51.91 v21.51,51.1 | 32U4.35 34.24,55.61 v34.66,54.95 | 32U4.43 29.86,62.01 v29.63,61.45
  Top 0.5: X4.5 87.54,11.92 v87.81,12.19
  Top 0.61: 22.43,60.39 v22.5,60.42 | CX2.1 7.96,63.86 v10.82,63.83 | v9.74,52.3 7.28,52.3 CX1.1 | BKLD.C 36.43,50.61 v37.71,50.61 | IC3.2 56.67,48.57 v56.63,48.53 | CU9.1 74.44,14.95 v74.07,14.92 | C10.2 34.41,66.17 v32.15,64.98 | SJ3.2 53.98,65.26 v53.09,64.36 | CU1.2 55.2,71.21 C6.2 57.63,73.58 WGT.4 | U$4.5 8.21,35.43 8.94,34.7 8.94,30.68 v10.15,29.47 | RK7.1 35.76,52.98 v37.18,54.4 | SJ2.1 28.88,68.8 v27.83,68.21 | X3.7 X3.8 13.11,79.08 v12.29,79.89 | SJ1.1 9.78,69.45 v9.78,66.93 | C13.1 26.94,77.09 v26.78,77.26 | C5.1 74.17,68.24 v73.11,68.49 | LDIN.C 80.7,50.35 v79.67,51.38 | LDOUT.C 85.83,44.71 v85.83,43.21 | U1.14 48.12,60.46 v47.74,60.08 | U$8.PIN1 6.97,47.61 8.28,48.91 9.49,48.91 v9.52,48.89 | LDPW12.C 23.05,26.18 v23.08,26.2 | LDPW3.C 22.92,28.73 v22.95,28.76 | LDPID.C 23.27,23.7 v23.33,23.64 | U$1.VSS 66.36,62.96 64.03,62.96 v63.33,62.26
  Top 0.813: C11.2 11.62,66.94 v9.78,66.93
  Top 1.016: 53.78,5.87 53.82,5.91 | Q1.3 63.64,53.51 v62.55,52.42 | Q4.3 42.1,27.71 v39.56,25.18 | Q2.3 42.71,36.47 v41.4,35.16 | 44.23,45.1 Q3.3 45.15,44.18 v45.15,42.57 | Q5.3 75.05,32.54 v75.05,31.35 | Q6.3 73.73,44.05 v73.73,43.58
  Bottom 0.406: v27.12,62.26 27.18,62.82 | SJ5.1 86.18,52.25 86.18,50.73 | SJ4.1 88.61,52.23 88.61,50.73 | SJ6.1 90.9,52.26 90.9,50.68
  Bottom 0.5: 36.32,80.78 30.7,80.78
  Bottom 0.61: v87.81,12.19 89.47,12.19 | v22.5,60.42 22.9,60.41 23.23,60.07 | 14.79,77.16 14.61,76.98 | 27.18,62.82 27.6,62.4 | v9.74,52.3 9.15,52.3 | v10.82,63.83 10.62,63.85 10.48,63.98 10.22,63.59 | v21.51,51.1 21.51,50.46 21.57,50.4 | 26.93,74.48 28.03,74.48 28.17,74.63 | v34.66,54.95 34.53,54.42 34.62,54.58 | v29.63,61.45 29.3,60.44 29.71,60.49 | v37.71,50.61 38.15,50 38.15,49.62 | v56.63,48.53 56.63,48.48 56.42,48.26 | v74.07,14.92 73.8,14.96 73.75,15.01 | v53.09,64.36 53.09,63.45 53.23,63.3 53.23,63.32 | v10.15,29.47 10.12,29.47 9.5,28.85 | v37.18,54.4 37.18,54.57 36.94,54.82 | v12.29,79.89 12.29,80.16 12.54,80.41 | v26.78,77.26 26.21,77.26 26.16,77.32 | 31.31,22.05 31.73,22.05 32.33,22.65 | v73.11,68.49 72.55,67.94 72.72,67.92 | 24.3,22.16 24.3,23.01 24.26,23.05 | v79.67,51.38 78.86,51.38 78.82,51.42 | v47.74,60.08 47.32,60.08 47.13,59.89 | v9.52,48.89 9.52,49.12 9.63,49.24 | v22.95,28.76 22.95,28.34 23.18,28.11 | v23.08,26.2 | v23.08,26.2 23.41,25.88 | v23.33,23.64 23.33,23.79 23.73,24.19 | v63.33,62.26 | v63.33,62.26 63,61.93 | 12.87,7.53 IC1.2 | CON_ISP.GND 36.37,78.52 | 36.37,80.74 36.32,80.78 | 30.7,80.78 29.3,79.38 19.77,79.38
  Bottom 0.813: v9.78,66.93 9.74,65.66 9.85,65.69
  Bottom 1.016: 62.24,24.81 62.24,23.44 61.87,23.07 | v39.56,25.18 38.67,25.18 38.63,25.14 | v41.4,35.16 41.4,34.33 41.07,33.99 | v45.15,42.57 45.41,42.31 45.63,42.31 | v75.05,31.35 74.45,30.75 74.45,30.38 | v73.73,43.58 73.28,44.03
  other vias: 10.57,21.63 9.39,21.62 11.71,21.2 11.76,20.08 11.79,18.88 11.78,17.73
  pour Top: 7.5,21.68 7.45,21.68 7.45,15.75 12.07,15.75 12.07,21.86 7.52,21.86 7.52,21.63
  pour Bottom: 4.88,85 72.93,85 72.93,52.33 95.55,52.33 95.55,-0.84 4.67,-0.84 4.67,84.96
HWB
  Top 0.406: RK7.2 30.34,52.98 32U4.33
ISP+5V
  Bottom 0.61: D2.A 36.37,74.45 CON_ISP.5V
LGND
  Top 0.5: 46.23,66.14 41.34,66.14 41.21,66.28 40.27,66.28
  Top 0.61: U1.5 45.58,72.79 8.2K.1 44.84,73.54 CU2.2 | 31.04,68.9 31.04,71.66 32.01,72.63 C8.1 35.36,74.09 C7.2 | 31.04,68.9 31.04,67.81 31.23,67.57 35.64,67.57 35.89,67.37 | SJ2.2 30.89,69.05 31.04,68.9 | 46.23,66.14 46.74,66.66 46.74,67.45 45.57,68.62 45.57,70.66 45.66,70.75
  pour Top: 56.91,77.59 40.54,77.59 35.69,72.73 35.69,62.38 37.39,60.67 60.36,60.67 63.17,63.49 63.17,74.86 60.66,77.37 58.22,77.35 57.89,77.55 57.34,77.53 57.14,77.55 56.95,77.55
MISO  (via drill 0.8 pad 0.81, 0.9 pad 0.61)
  Top 0.406: v30.25,74.51 33.5,77.66 37.98,77.66 39.89,79.67 52.27,79.67 52.28,79.66 59.02,79.68 61.32,77.37 61.33,77.36 77.72,77.36 78.11,76.97 78.11,74.77 77.51,74.17 73.62,74.17 72.91,73.46 72.91,71.14 71.1,69.32 69.44,69.32 68.94,68.82 68.94,66.51 67.85,65.42 U$1.SO | 32U4.11 20.97,64.61 v17.8,67.78 17.8,70.06 17.25,70.61 X3.5
  Bottom 0.406: 28.25,73.26 21,73.26 17.8,70.06 v17.8,67.78 | 28.25,73.26 30.85,73.26 CON_ISP.MISO | v30.25,74.51 29.5,74.51 28.25,73.26
MOSI  (via drill 0.8, 0.8 pad 0.81, 0.9 pad 0.61)
  Top 0.406: 32U4.10 23.11,65.8 22.31,66.6 21.25,66.6 19.12,68.73 19.12,69.78 | 19.12,69.78 19.12,70.86 18.25,71.73 X3.4 | 20.11,70.78 19.12,69.78
  Top 0.61: v29.68,72 34.31,76.62 38.16,76.62 40.41,78.78 53.06,78.78 53.22,78.78 58.59,78.76 61.35,76.1 68.95,76.1 69.73,75.32 75.64,75.32 v76.41,76.09 | v20.42,70.78 20.11,70.78 | U$1.SI 77.67,62.88 79.28,64.49 79.28,70.92 v77.86,72.35 77.66,72.54 74.78,72.54 RK4.1
  Bottom 0.61: CON_ISP.MOSI 36.83,77.25 37.92,76.16 37.92,72.48 36.13,70.69 28.29,70.69 | 28.29,70.69 23.57,70.69 22.33,71.93 21.58,71.93 v20.42,70.78 | v29.68,72 29.6,72 28.29,70.69 | v76.41,76.09 76.41,73.8 v77.86,72.35
N$1
  Top 0.406: 32U4.6 26.32,68.62 27.1,69.4 27.1,71.32
  Top 0.61: 27.1,71.32 C13.2
N$3
  Top 0.61: BKLD.A 34.22,50.72 R2.2
N$5
  Top 0.61: U1.3 48.12,71.43 BJ1.3 48.19,71.71 48.6,72.13 48.6,74.2 48.99,74.59 48.99,75.24 | 48.99,75.24 48.99,75.61 | 48.99,75.61 20K.2 | 48.99,75.61 57.67,75.61 WGT.5 | 48.99,75.24 49.07,75.32 49.07,76.95 48.73,77.29 45.62,77.29 44.66,76.34 CU2.1 41.99,76.96 40.19,76.96 38.95,75.72 C7.1
N$6
  Top 0.61: R11.2 16.66,16.95 15.08,18.52 | 15.08,18.52 HX1.1 | 15.29,19.56 15.09,19.36 15.09,19.22 | 15.09,19.22 15.09,18.54 15.08,18.52 | RK14.2 14.74,19.57 15.09,19.22
N$7
  Top 0.61: R12.1 19.14,26.21 LDPW12.A
N$8
  Top 0.61: R5.2 51.05,53.72 51.05,52.9 53.14,50.81 56.05,50.81 60.28,55.05 71.5,55.05 75.95,50.59 Q6.1 79.05,48.35 RK12.2
N$9
  Top 0.61: R10.2 13.52,40.99 RT2.2 12.54,40.51 12.1,40.07 12.1,36.42 U$4.4
N$10
  Top 0.61: U$1.CE 64.78,66.69 R3.1
N$11
  Top 0.61: R6.2 56.79,52.86 60.14,56.2 74.57,56.2 77.73,53.04 80.19,53.04 87.54,45.69 87.54,42.54 86.48,41.49 81.33,41.49 | Q5.1 77.19,37.34 81.33,41.49 | 81.33,41.49 RK13.2
N$13
  Top 0.813: OUT.2 75.56,36.62 Q5.2
N$14
  Top 0.61: RK8.1 67.02,31.24 STEPPER.1
  Top 1.016: Q4.2 46.19,27.04 50.84,22.39 64.54,22.39 67.87,25.72 67.87,31.23 STEPPER.1
N$15
  Top 0.61: RK9.1 63.43,35.26 STEPPER.3
  Top 1.016: Q2.2 46.48,35.6 49.16,32.92 54.52,32.92 55.59,31.86 57.2,31.86 60.02,34.68 62.43,34.68 STEPPER.3
N$16  (via drill 0.8)
  Top 0.61: RK10.1 STEPPER.4
  Top 1.016: Q3.2 46.64,44.3 48.62,42.32 53.44,42.32 v54.5,43.38
  Bottom 1.016: v54.5,43.38 54.5,41.18 59.05,36.62 60.78,36.62 STEPPER.4
N$17
  Top 1.016: Q6.2 74.47,46.72 75.43,45.76 76.52,43.27 74.17,40.92 71.24,40.92 IN.2
N$18
  Top 0.61: RK15.2 19.75,49.32 TXLD.A
N$19
  Top 0.61: RK11.1 55.78,41.06 STEPPER.6
  Top 1.016: Q1.2 67.58,51.02 69.26,49.34 70.61,49.34 71.07,48.89 71.07,46.42 70.13,45.48 66.98,45.48 66.03,44.52 61.5,44.52 STEPPER.6
N$20  (via drill 0.9 pad 0.81)
  Top 0.61: RL1.1 34.75,70.77 43,70.77 43.04,70.73 U1.7 43.04,68.23 43.88,67.4 v44.83,67.4
  Bottom 0.61: C9.2 44.34,67.89 v44.83,67.4
N$21
  Top 0.61: U$8.PIN2 8.86,43.2 9.86,42.19 10.05,42.19 RT1.2 11.91,43.62 R9.2
N$22
  Top 0.61: LDSLAVE.A 8.8,76.07 RK18.2
N$23  (via drill 0.8)
  Top 0.61: U$1.SCK 72.56,64.15 v71.61,63.75 | RK3.2 74.87,80.24 73.1,81.87 v72.4,81.85
  Bottom 0.61: v71.61,63.75 71.63,64.04 71.57,81.22 v72.4,81.85
N$24
  Top 0.61: RXLD.A 24.88,71.52 RK16.2
N$25
  Top 0.61: RK19.2 LDMEM.A
N$26
  Top 0.61: RK14.1 19.15,23.6 LDPID.A
N$27
  Top 0.61: RK12.1 80.76,47.4 LDIN.A
N$28
  Top 0.61: RK13.1 82.44,45.26 LDOUT.A
N$29
  Top 0.61: IC3.6 64.28,49.52 65.21,48.59 65.21,46.93 64.15,45.87 57.83,45.87 57.11,45.15 53,45.15 52.17,44.32 49.63,44.32 Q3.1
N$30  (via drill 0.8 pad 0.81)
  Top 0.61: IC3.4 63.54,47.62 v63.61,47.56 | v71.74,52.05 71.35,52.05 Q1.1
  Bottom 0.61: v63.61,47.56 67.26,47.56 v71.74,52.05
N$31
  Top 0.61: RK8.2 62.1,28.72 LDM4.C
N$32
  Top 0.61: LDM3.C 59.51,31.15 RK9.2
N$33
  Top 0.61: RK10.2 55.73,35.3 LDM2.C
N$34
  Top 0.61: LDPW3.A R14.2
N$36
  Top 3.81: J7.2 12.68,7.93 HX1.2
N$37
  Top 0.61: LDM1.C RK11.2
N$38
  Top 0.61: U1.2 49.39,70.21 BJ1.1
N$39
  Top 0.61: U1.4 46.85,70.87 8.2K.2 46.87,75.71 20K.1
N$41
  Top 0.61: RK5.1 49.41,63.79 U1.15 49.39,65.4 50.6,66.61 SJ3.1
N$42
  Top 0.406: 32U4.17 13.82,58.81 X2.P$2
  Top 0.61: CX1.2 11.45,55.78 12.04,56.37 11.49,56.37 X2.P$2 9.92,57.94 RXT.2
N$43  (via drill 0.9 pad 0.81)
  Top 0.61: RL2.1 40.06,69.41 U1.8 41.77,67.43 v41.89,67.33
  Bottom 0.61: C9.1 42.17,69.73 42.17,67.59 v41.89,67.33
RESET  (via drill 0.8 pad 0.81)
  Top 0.406: 32U4.13 19.05,62.01 16.43,64.63 16.43,65.75 15.13,67.05
  Top 0.61: 14.69,66.92 C11.1 | C11.1 14.56,68.25 13.38,69.43 11.43,69.43 SJ1.2 11.35,71.86 RK6.1 12.49,71.86 v13.67,73.01 | 15.13,67.05 14.58,67.05 C11.1
  Bottom 0.61: CON_ISP.RESET 19.15,78.52 v13.67,73.01
RX  (via drill 0.8, 0.9 pad 0.61)
  Top 0.406: 32U4.20 20.48,56.38 17.04,56.38 16.48,55.82 16.48,53.58 15.88,52.98 v15.88,49.61 | v15.91,42.82 15.91,40.27 21.72,34.46 30.85,34.46 41.02,44.63 41.02,45.73 43.61,48.33 43.61,52.02 v45.21,53.24 | v53.68,58.07 57.93,58.07 59.47,59.62 66.34,59.62 v66.78,60.06
  Bottom 0.406: 15.91,49.57 v15.91,42.82 | v53.68,58.07 53.08,58.68 52.09,58.68 49.33,61.44 47.16,61.44 45.21,59.49 v45.21,53.24 | U100.P$6 67.46,60.72 v66.78,60.06
  Bottom 0.61: v15.88,49.61 15.91,49.57
RXLED
  Top 0.406: 32U4.8 24.71,67.72
  Top 0.61: 24.71,67.72 RXLD.C
SCK  (via drill 0.8 pad 0.81, 0.9 pad 0.61)
  Top 0.406: 32U4.9 23.91,66.54 21.26,69.19 21.26,69.71 21.87,70.32 21.87,71.25 19.25,73.87 19.25,77.84 | X3.3 19.25,77.84 | 20.79,76.29 19.25,77.84
  Top 0.61: v20.84,76.29 20.79,76.29 | RK3.1 71.64,78.64 61.56,78.64 58.51,81.69 32.01,81.69 29.82,79.5 v29.82,77.2
  Bottom 0.61: 28.26,75.79 31.27,75.79 32.68,77.2 33.52,77.2 CON_ISP.SCK | v29.82,77.2 29.68,77.2 28.26,75.79 | 28.26,75.79 21.35,75.79 v20.84,76.29
SCL  (via drill 0.8 pad 0.81)
  Top 0.406: RK2.2 11.6,54.08 11.8,54.29 13.07,54.29 14.37,55.59 14.37,57.11 15.27,58.01 32U4.18 20.53,58.01 21.69,58.01 22.52,58.85 v23.57,58.85
  Top 0.61: J2.SCL 66.05,5.96 67.2,7.13 71.73,7.13 J1.SCL
  Bottom 0.61: J2.SCL 56.85,5.96 58.66,7.76 58.66,8.9 55.81,11.74 55.81,26.45 23.57,58.68 v23.57,58.85
SDA  (via drill 0.8 pad 0.81)
  Top 0.406: RK1.2 15.4,54.09 15.4,56.48 16.13,57.21 32U4.19 20.53,57.23 v23.03,57.23
  Top 0.61: J1.SDA 71.88,9.15 71.06,9.97 61.89,9.97 59.15,7.23 55.95,7.23 J2.SDA
  Bottom 0.61: v23.03,57.23 23.07,57.23 54.71,25.58 54.71,8.52 J2.SDA
TX  (via drill 0.8, 0.9 pad 0.61)
  Top 0.406: 32U4.21 20.48,55.57 17.89,55.57 17.36,55.04 v17.36,50.84 | v17.34,45.33 17.34,40.32 21.93,35.73 30.6,35.73 39.97,45.1 39.97,46.2 42.4,48.63 42.4,52.95 v43.46,54.01 | v53.8,59.83 58.17,59.83 58.92,60.58 64.17,60.58 v65.17,61.57
  Bottom 0.406: 17.34,50.83 v17.34,45.33 | v43.46,54.01 43.46,59.06 46.75,62.34 49.8,62.34 52.32,59.83 v53.8,59.83 | U100.P$7 73.55,61.99 73.13,61.57 v65.17,61.57
  Bottom 0.61: v17.36,50.84 17.34,50.83
TXLED
  Top 0.406: 32U4.22 19.93,54.81 19.63,54.51 19.63,53.68
  Top 0.61: 19.63,53.68 TXLD.C
USB_N  (via drill 0.3)
  Top 0.406: RUSB1.1 87.12,22.16 87.12,28.98 90.7,32.55 90.7,37.01 88.17,39.54 v88,39.38 | v29.12,66.52 28.71,66.12 32U4.3
  Bottom 0.406: v88,39.38 88.17,39.54 87.41,40.3 81.34,40.3 75.82,45.82 65.18,45.82 63.99,44.64 61.29,44.64 59.71,46.22 59.71,48.62 61.25,50.16 64.37,50.16 65.79,51.57 65.79,53.82 53.34,66.27 50,66.27 47.93,64.2 43.71,64.2 40.65,61.13 40.65,59.35 35.84,59.35 33.63,61.56 33.63,65.93 32.8,66.76 29.36,66.76 v29.12,66.52
USB_P  (via drill 0.3)
  Top 0.406: RUSB2.1 87.78,18.92 87.78,28.71 91.35,32.28 91.35,37.28 88.63,40.01 v88.79,40.17 | v27.93,66.68 27.93,64.62 32U4.4
  Bottom 0.406: v88.79,40.17 88.63,40.01 87.68,40.96 81.62,40.96 76.29,46.29 | 76.29,46.29 | 76.29,46.29 76,46.58 65,46.58 63.72,45.3 61.56,45.3 60.37,46.49 60.37,48.35 61.52,49.5 64.65,49.5 66.44,51.3 66.44,54.09 53.5,67.04 49.84,67.04 47.66,64.85 43.44,64.85 39.99,61.41 39.99,60 36.12,60 34.29,61.83 34.29,66.2 33.07,67.42 28.66,67.42 v27.93,66.68
USBC_N
  Top 0.406: X4.2 85.11,9.01 85.11,14.42 84.16,15.37 RUSB1.2
USBC_P
  Top 0.406: X4.3 85.91,8.97 85.91,14.39 87.47,15.95 RUSB2.2
VUSB  (via drill 0.8, 0.8 pad 0.81)
  Top 0.406: 32U4.7 25.52,61.49 26.02,60.98 26.02,58.43 v28.76,56.88 | v59.35,14.85 60.45,13.68
  Top 0.5: X4.1 84.34,10.71 81.79,13.25 81.21,13.25 79.57,14.89 CU9.2
  Top 0.61: v48.74,14.73 48.76,14.53 49.61,13.68 60.45,13.68 72.1,13.68 72.46,14.04 72.46,15.71 73.58,16.83 77.74,16.83 78.75,15.81 CU9.2
  Bottom 0.406: v28.76,56.88 29.02,56.23 59.35,25.89 v59.35,14.85
  Bottom 0.61: D4.A 48.8,15.22 v48.74,14.73
XTAL1
  Top 0.406: 32U4.16 13.48,59.61
  Top 0.61: 13.48,59.61 X2.P$1 | X2.P$1 6.97,61.65 CX2.2 | RXT.1 9.62,59.84 X2.P$1

### Text on the board
tNames: SPI | D11 | Rx | IF LoRa | BerthaV4.2 | Tx | BerthaV4.2 | IN | BLK | OUT | GND | A2 | OPT | A6 | A0 | 5V | MEM SELECT | A3 | A1 | OPT | 3V3 | 12V | PID | BerthaV4.2 | D12 | BerthaV4.2
bNames: LoRa RN2483
tValues: Screen | PID
203bmp: C:/Users/G/Pictures/logo_epfl.bmp